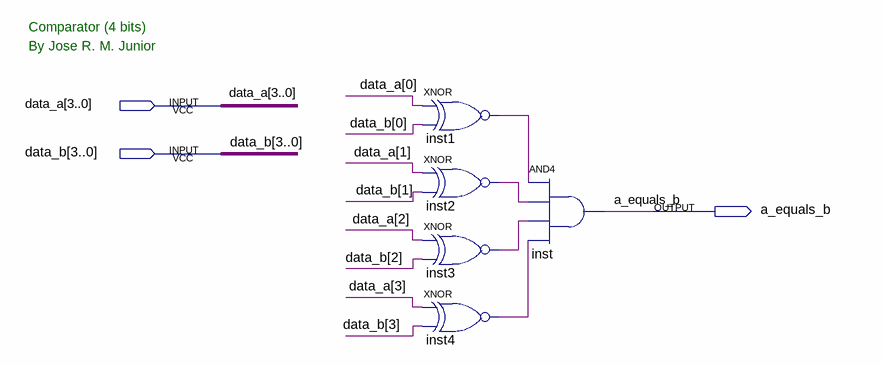
[diagram p0: schematic sheet]
// Quartus schematic comparator_4bits.bdf as structural Verilog: 5 symbols, 3 pins
module comparator_4bits (
  input  [3:0] data_a,
  input  [3:0] data_b,
  output a_equals_b
);

  wire inst1_out, inst2_out, inst3_out, inst4_out;

  xnor inst1 (inst1_out, data_a[0], data_b[0]);
  xnor inst2 (inst2_out, data_a[1], data_b[1]);
  xnor inst3 (inst3_out, data_a[2], data_b[2]);
  xnor inst4 (inst4_out, data_a[3], data_b[3]);
  and inst (a_equals_b, inst1_out, inst2_out, inst3_out, inst4_out);

  // Notes on the sheet:
  //   Comparator (4 bits)
  //   By Jose R. M. Junior
endmodule
